# EasyEDA schematic SCH_Smart-circular-LED-Lamp-PCB_2025-01-14.json
TITLE: Sheet_1; REV: 1.0; Date: 2025-01-14; Sheet: 1/1; Drawn By: med.anis.ziadi; Company: Your Company
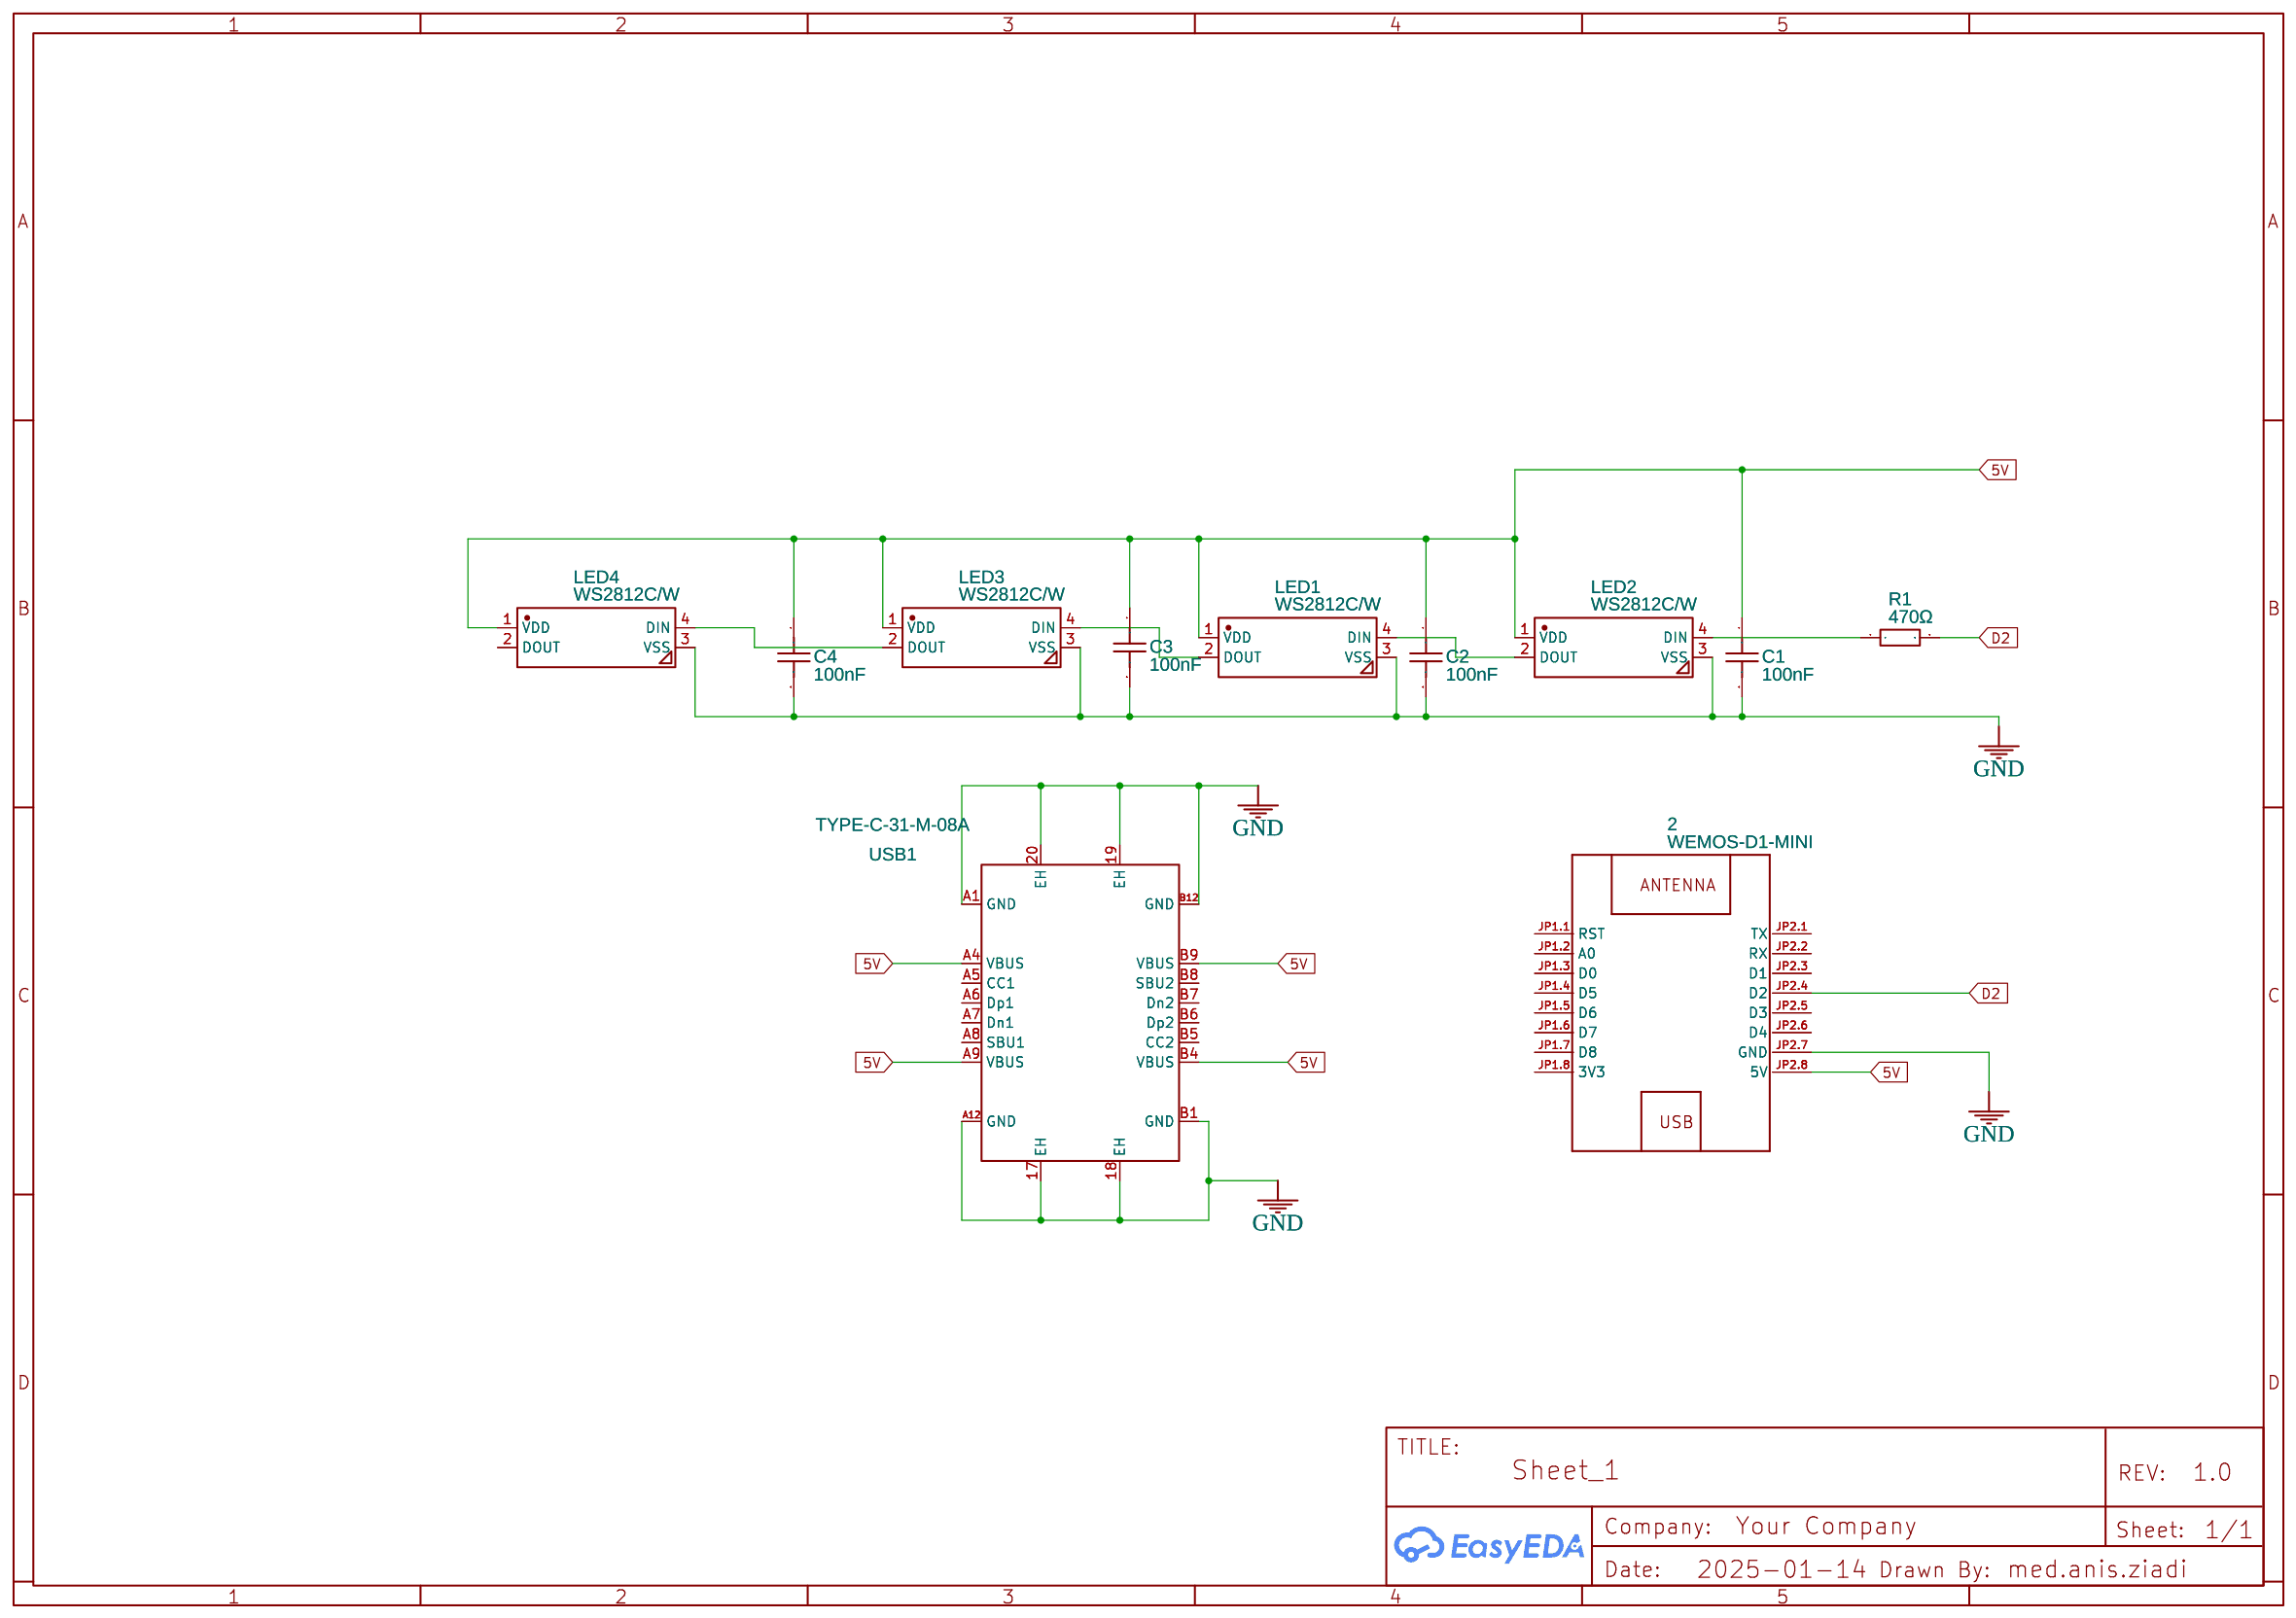
[diagram p0: schematic sheet]

## Parts
2  WEMOS-D1-MINI  [WEMOS-D1-MINI]
C1  100nF  [C0603]
C2  100nF  [C0603]
C3  100nF  [C0603]
C4  100nF  [C0603]
LED1  WS2812C/W  [LED-SMD_4P-L5.0-W5.0-TL_WS2812B-B]
LED2  WS2812C/W  [LED-SMD_4P-L5.0-W5.0-TL_WS2812B-B]
LED3  WS2812C/W  [LED-SMD_4P-L5.0-W5.0-TL_WS2812B-B]
LED4  WS2812C/W  [LED-SMD_4P-L5.0-W5.0-TL_WS2812B-B]
R1  470Ω  [R0603]
USB1  TYPE-C-31-M-08A  [USB-C-SMD_TYPE-C-31-M-08A]

## Library data of the parts
2 = WEMOS-D1-MINI: Contributor: MAYURESH INAMDAR
C1-C4 = AC0603KRX7R8BB104: Contributor: LCSC; Supplier: LCSC; Supplier Part: C327096; Manufacturer: YAGEO(国巨); JLCPCB Part Class: Extended Part
LED1-LED4 = WS2812C/W: Contributor: LCSC; Supplier: LCSC; Supplier Part: C2761796; Manufacturer: worldsemi; JLCPCB Part Class: Extended Part
R1 = CR0603JA0471G: Supplier: LCSC; Manufacturer: LIZ(丽智电子); Supplier Part: C101353; JLCPCB Part Class: Extended Part
USB1 = TYPE-C-31-M-08A: Contributor: LCSC; Supplier: LCSC; Supplier Part: C2848616; Manufacturer: 韩国韩荣; JLCPCB Part Class: Extended Part

## Nets
5V: 2.JP2.8(5V) C1.1 C2.1 C3.1 C4.1 LED1.1(VDD) LED2.1(VDD) LED3.1(VDD) LED4.1(VDD) USB1.A4(VBUS) USB1.A9(VBUS) USB1.B4(VBUS) USB1.B9(VBUS)
GND: 2.JP2.7(GND) C1.2 C2.2 C3.2 C4.2 LED1.3(VSS) LED2.3(VSS) LED3.3(VSS) LED4.3(VSS) USB1.17(EH) USB1.18(EH) USB1.19(EH) USB1.20(EH) USB1.A1(GND) USB1.A12(GND) USB1.B1(GND) USB1.B12(GND)
D2: 2.JP2.4(D2) R1.2
Net-(LED1-2): LED1.2(DOUT) LED3.4(DIN)
Net-(LED1-4): LED1.4(DIN) LED2.2(DOUT)
Net-(LED2-4): LED2.4(DIN) R1.1
Net-(LED3-2): LED3.2(DOUT) LED4.4(DIN)

Not connected (* = marked no-connect by the designer): 2 JP1.1(RST) JP1.2(A0) JP1.3(D0) JP1.4(D5) JP1.5(D6) JP1.6(D7) JP1.7(D8) JP1.8(3V3) JP2.1(TX) JP2.2(RX) JP2.3(D1) JP2.5(D3) JP2.6(D4); LED4 2(DOUT); USB1 A5(CC1) A6(Dp1) A7(Dn1) A8(SBU1) B5(CC2) B6(Dp2) B7(Dn2) B8(SBU2)
